# EAGLE schematic Blend V2.0 20170309 (EAGLE 7.5.0)
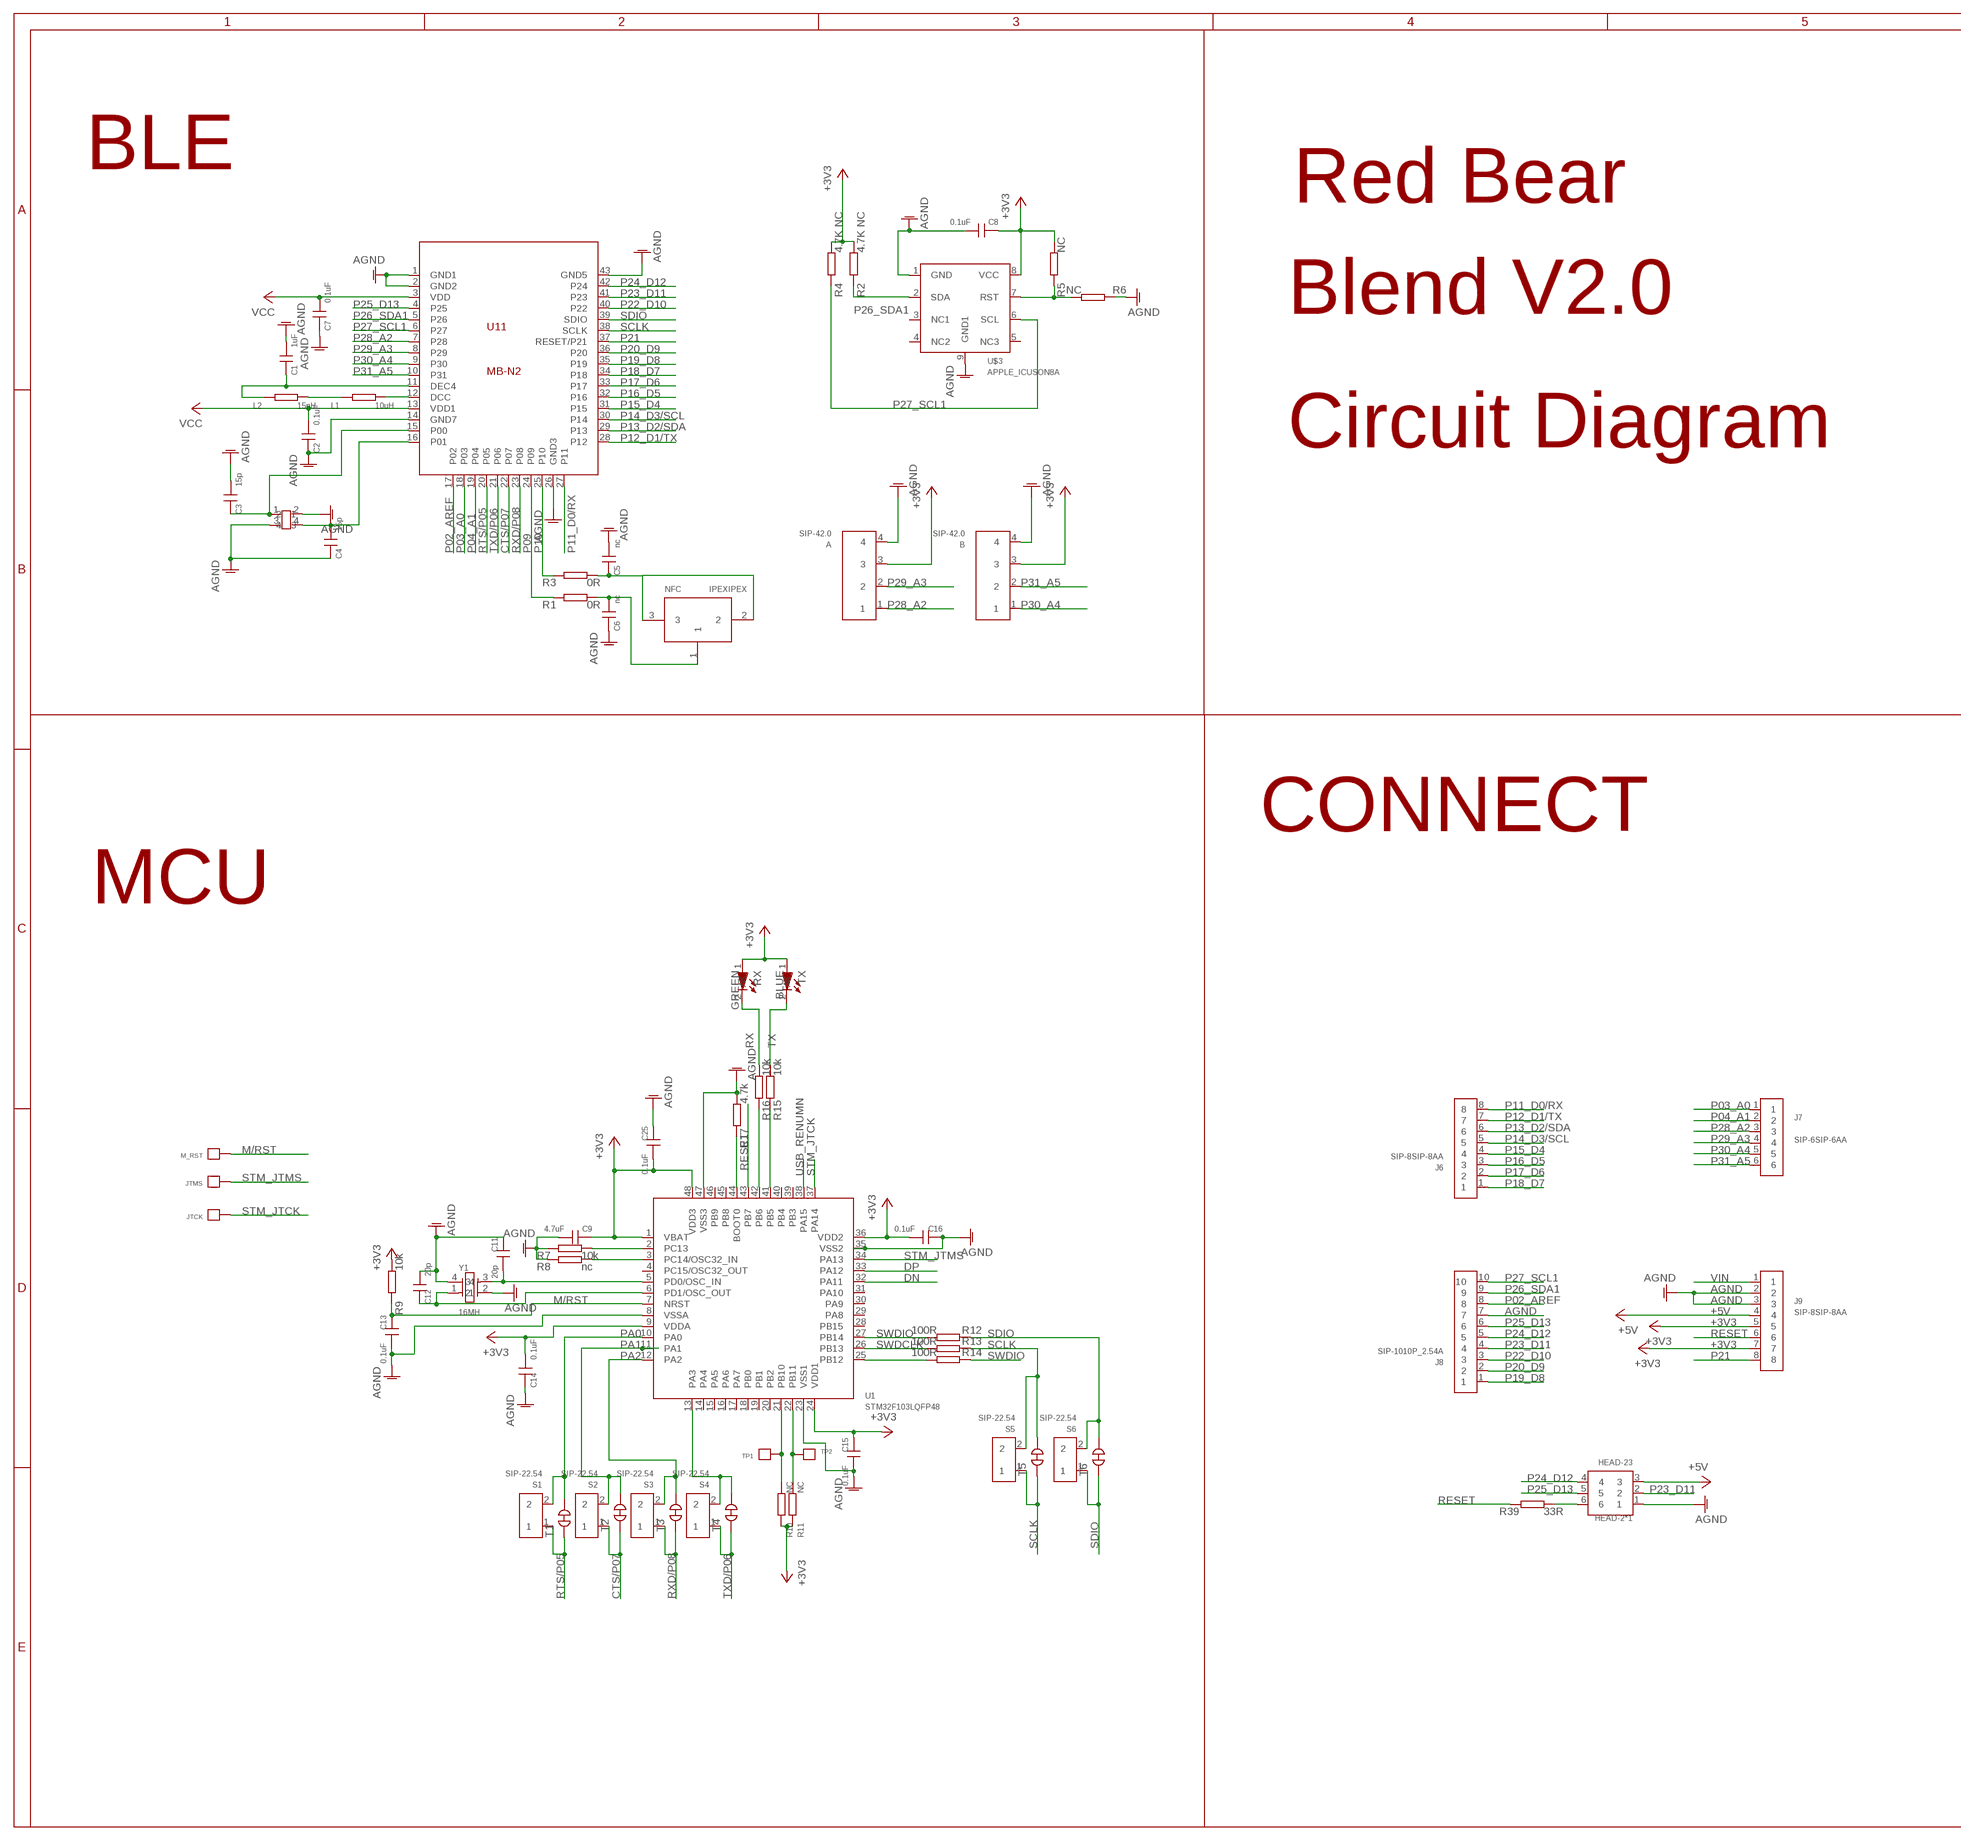
[diagram p0: schematic, sheet 1, part 1 of 2]
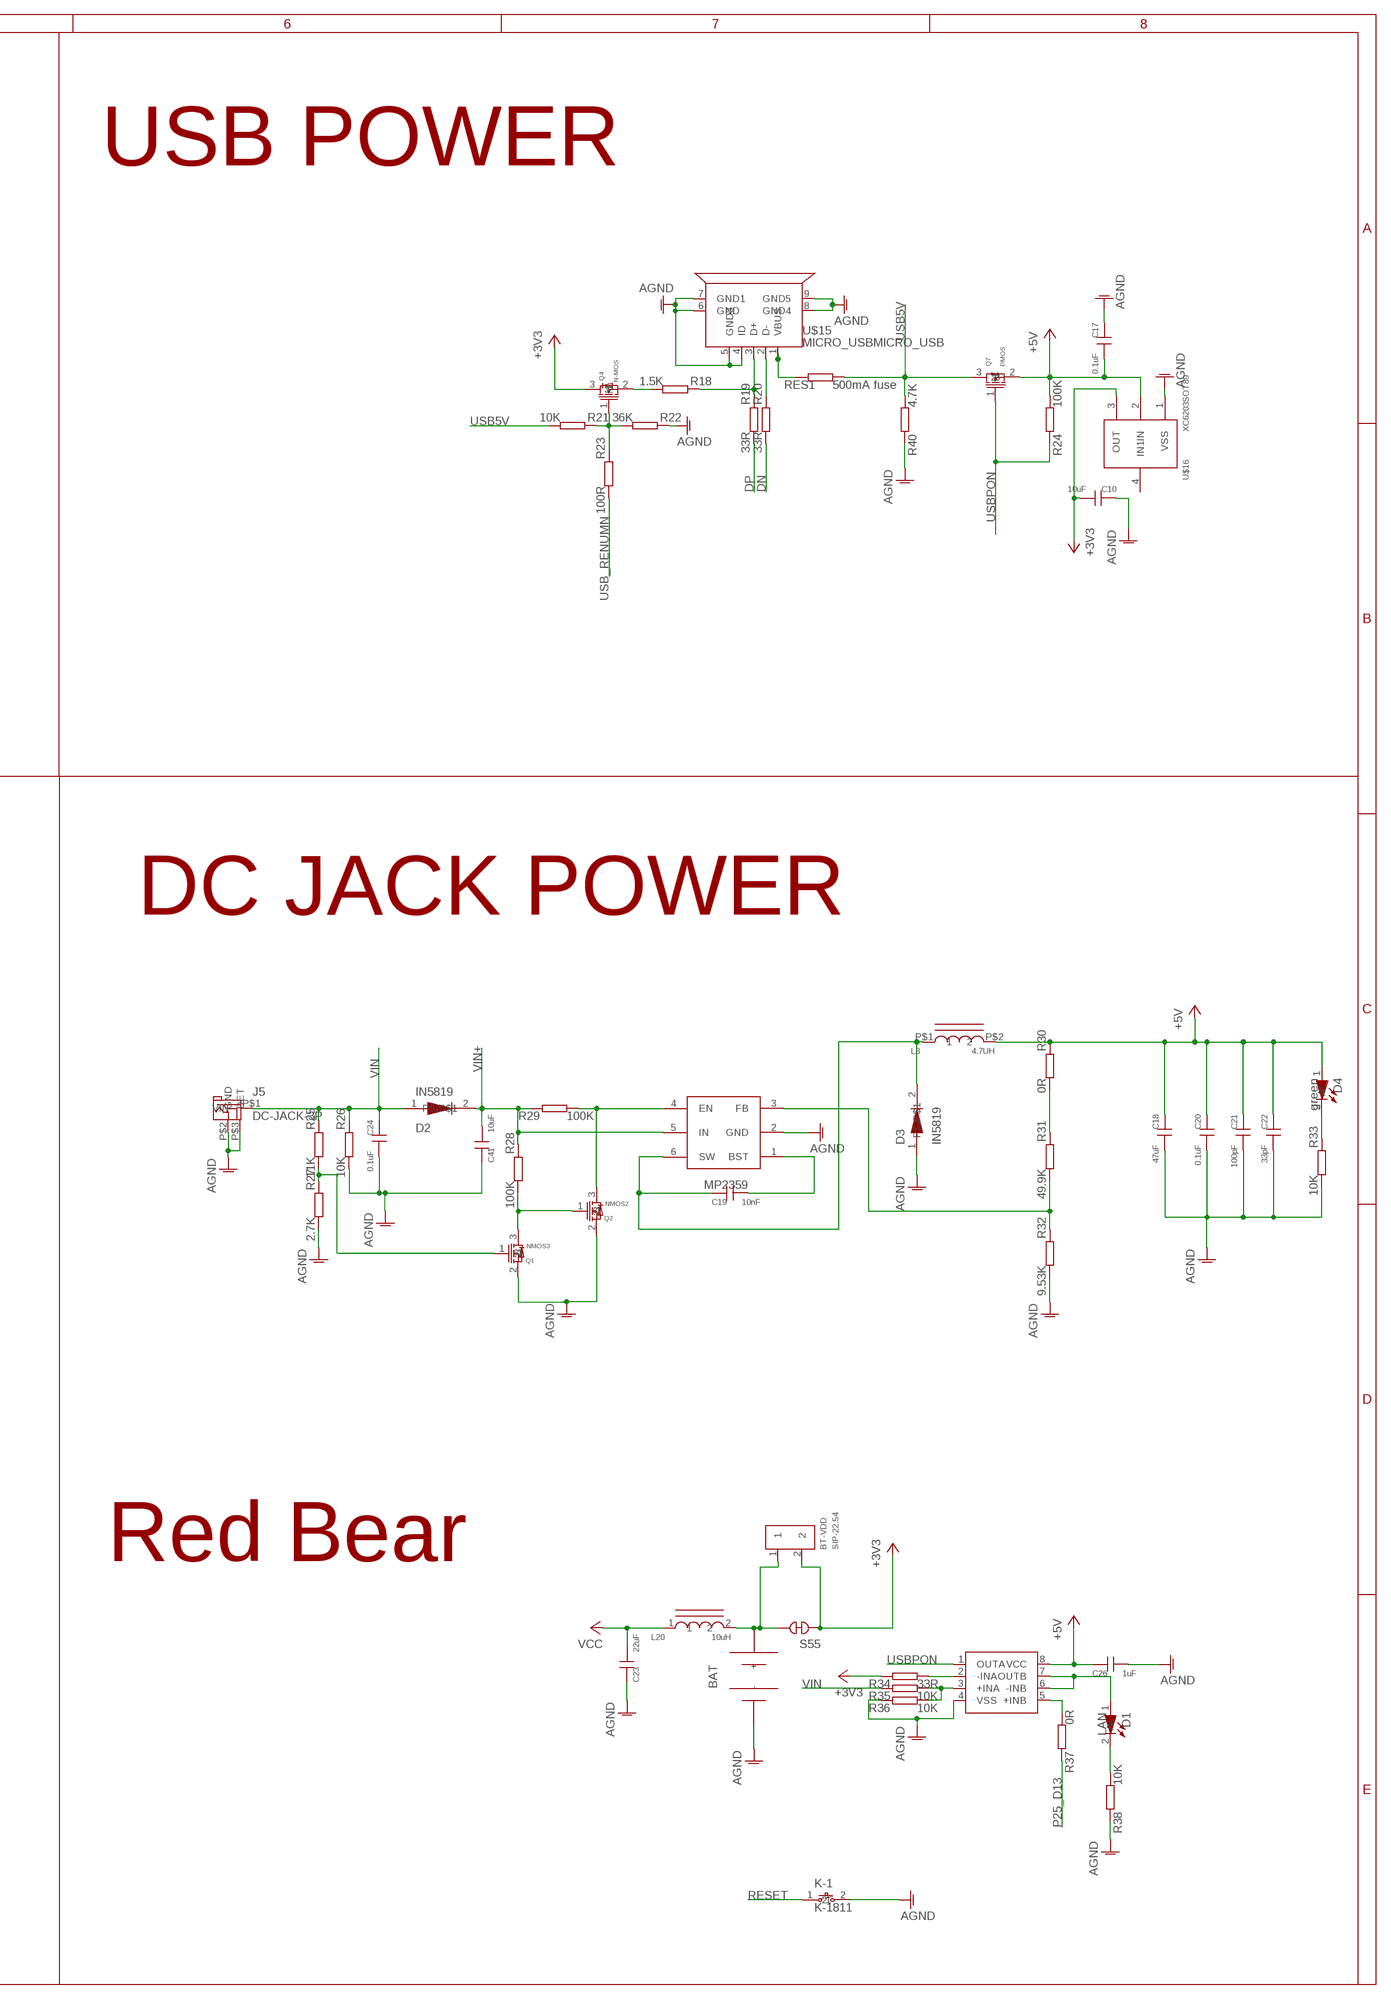
[diagram p1: schematic, sheet 1, part 2 of 2]

## Parts
A  SIP-42.0  [CONETER-4-2.0]
B  SIP-42.0  [CONETER-4-2.0]
BAT  BAT  [BAT]
BT-VDD  SIP-22.54  [SIP-2]
C1  1uF  CAP0402  [C-0402]
C2  0.1uF  CAP0402  [C-0402]
C3  15p  CAP0402  [C-0402]
C4  15p  CAP0402  [C-0402]
C5  nc  CAP0402  [C-0402]
C6  nc  CAP0402  [C-0402]
C7  0.1uF  CAP0402  [C-0402]
C8  0.1uF  CAP0402  [C-0402]
C9  4.7uF  CAP0402  [C-0402]
C10  10uF  CAPC0805  [C0805]
C11  20p  CAP0402  [C-0402]
C12  20p  CAP0402  [C-0402]
C13  0.1uF  CAP0402  [C-0402]
C14  0.1uF  CAP0402  [C-0402]
C15  0.1uF  CAP0402  [C-0402]
C16  0.1uF  CAP0402  [C-0402]
C17  0.1uF  CAP0402  [C-0402]
C18  47uF  CAPC1206  [C1206]
C19  10nF  CAP0402  [C-0402]
C20  0.1uF  CAP0402  [C-0402]
C21  100pF  CAP0402  [C-0402]
C22  33pF  CAP0402  [C-0402]
C23  22uF  CAPC0805  [C0805]
C24  0.1uF  CAP0402  [C-0402]
C25  0.1uF  CAP0402  [C-0402]
C26  1uF  CAP0402  [C-0402]
C41  10uF  CAPC1206  [C1206]
D1  LAN  LEDLED-0603  [LED-0603]
D3  IN5819  DIODED-1810  [D-1810]
D4  green  LEDLED-0603  [LED-0603]
HEAD-2*1  HEAD-23  [PAIZHEN3X2PIN2.54]
IN5819  D2  DIODED-1810  [D-1810]
J5  DC-JACK-3P  DC-005DC-005  [DC-005]
J6  SIP-8SIP-8AA  [PAIZHEN8P_2.54AA]
J7  SIP-6SIP-6AA  [PAIZHEN6P_2.54AA]
J8  SIP-1010P_2.54A  [PAIZHEN10P-2.54A]
J9  SIP-8SIP-8AA  [PAIZHEN8P_2.54AA]
JTCK  TPTP  [TP]
JTMS  TPTP  [TP]
K-1  K-1811  [K2-1101F]
L1  10uH  RESR0603  [R0603]
L2  15nH  RES0402S  [R-0402S]
L3  4.7UH  LL4X4  [L4X4]
L20  10uH  L  [R-0603A]
M_RST  TPTP  [TP]
MP2359  MP2359  [MP2359]
NFC  IPEXIPEX  [IPEX]
NMOS2  Q2  NMOSSOT-23  [SOT-23]
NMOS3  Q1  NMOSSOT-23  [SOT-23]
Q4  N-MOS  NMOSSOT-23  [SOT-23]
Q7  PMOS  [SOT-23]
R1  0R  RESR0402  [R0402]
R2  4.7K NC  RESR0402  [R0402]
R3  0R  RESR0402  [R0402]
R4  4.7K NC  RESR0402  [R0402]
R5  NC  RESR0402  [R0402]
R6  NC  RESR0402  [R0402]
R7  10k  RESR0402  [R0402]
R8  nc  RESR0402  [R0402]
R9  10k  RESR0402  [R0402]
R10  NC  RESR0603  [R0603]
R11  NC  RESR0603  [R0603]
R12  100R  RESR0402  [R0402]
R13  100R  RESR0402  [R0402]
R14  100R  RESR0402  [R0402]
R15  10k  RESR0402  [R0402]
R16  10k  RESR0402  [R0402]
R17  4.7k  RESR0402  [R0402]
R18  1.5K  RESR0402  [R0402]
R19  33R  RESR0402  [R0402]
R20  33R  RESR0402  [R0402]
R21  10K  RESR0402  [R0402]
R22  36K  RESR0402  [R0402]
R23  100R  RESR0402  [R0402]
R24  100K  RESR0402  [R0402]
R25  11K  RESR0402  [R0402]
R26  10K  RESR0402  [R0402]
R27  2.7K  RESR0402  [R0402]
R28  100K  RESR0402  [R0402]
R29  100K  RESR0402  [R0402]
R30  0R  RESR0402  [R0402]
R31  49.9K  RESR0402  [R0402]
R32  9.53K  RESR0402  [R0402]
R33  10K  RESR0402  [R0402]
R34  33R  RESR0402  [R0402]
R35  10K  RESR0402  [R0402]
R36  10K  RESR0402  [R0402]
R37  0R  RESR0402  [R0402]
R38  10K  RESR0402  [R0402]
R39  33R  RESR0402  [R0402]
R40  4.7K  RESR0402  [R0402]
RES1  500mA fuse  RES  [R1206A]
RX  GREEN  LED  [LED0603]
S1  SIP-22.54  [SIP-2]
S2  SIP-22.54  [SIP-2]
S3  SIP-22.54  [SIP-2]
S4  SIP-22.54  [SIP-2]
S5  SIP-22.54  [SIP-2]
S6  SIP-22.54  [SIP-2]
S55  TP_OPEN  [TP_OPEN]
T1  TP_OPEN  [TP_OPEN]
T2  TP_OPEN  [TP_OPEN]
T3  TP_OPEN  [TP_OPEN]
T4  TP_OPEN  [TP_OPEN]
T5  TP_OPEN  [TP_OPEN]
T6  TP_OPEN  [TP_OPEN]
TP1  TPTP  [TP]
TP2  TPTP  [TP]
TX  BLUE  LED  [LED0603]
U1  STM32F103LQFP48  [LQFP-48-7X7]
U11  MB-N2  RBT07  [RBT07]
U$2  CRY_7015  [CRY_7015_SMT]
U$3  APPLE_ICUSON8A  [USON8_A]
U$15  MICRO_USBMICRO_USB  [MICRO_USB]
U$16  XC6203SOT89  [SOT-89]
U$19  SGM358  [SOP-8]
Y1  16MH  CRY3225  [CRY_3225_SMT]

## Nets
+3V3: A.3 B.3 BT-VDD.2 C8.2 C9.2 C10.1 C14.1 C15.2 C16.1 C25.1 J9.5 J9.7 Q4.3 R2.2 R4.2 R5.2 R9.2 R10.1 R11.1 R34.1 RX.1(A) S55.P$2 TX.1(A) U1.1(VBAT) U1.9(VDDA) U1.24(VDD1) U1.36(VDD2) U1.48(VDD3) U$3.8(VCC) U$16.3(OUT)
+5V: C17.1 C18.2 C20.2 C21.2 C22.2 C26.2 D4.1(A) HEAD-2*1.3 J9.4 L3.P$2 Q7.2 R24.2 R30.1 U$16.2(IN) U$19.8(VCC)
AGND: A.4 B.4 BAT.P$2(-) C1.1 C2.2 C3.1 C4.2 C5.1 C6.2 C7.2 C8.1 C9.1 C10.2 C11.2 C12.1 C13.1 C14.2 C15.1 C16.2 C17.2 C18.1 C20.1 C21.1 C22.1 C23.2 C24.1 C25.2 C26.1 C41.2 D3.1 HEAD-2*1.1 J5.P$2(GND) J5.P$3(DET) J8.7 J9.2 J9.3 K-1.2 MP2359.2(GND) NMOS2.2 NMOS3.2 R6.1 R7.1 R8.1 R17.2 R22.1 R26.2 R27.2 R32.2 R33.2 R36.1 R38.1 R40.1 U1.8(VSSA) U1.23(VSS1) U1.35(VSS2) U1.47(VSS3) U11.1(GND1) U11.2(GND2) U11.14(GND7) U11.26(GND3) U11.43(GND5) U$2.2 U$2.3 U$3.1(GND) U$3.9(GND1) U$15.4(ID) U$15.5(GND3) U$15.6(GND) U$15.7(GND1) U$15.8(GND4) U$15.9(GND5) U$16.1(VSS) U$19.4(VSS) Y1.2 Y1.4
CTS/P07: S2.1 T2.P$2 U11.22(P07)
DN: R20.2 U1.32(PA11)
DP: R19.2 U1.33(PA12)
M/RST: C13.2 M_RST.P$1 R9.1 U1.7(NRST)
MP2359: C19.1 MP2359.1(BST)
N$1: L1.1 L2.2
N$2: L1.2 U11.12(DCC)
N$3: C1.2 L2.1 U11.11(DEC4)
N$5: C3.2 U11.15(P00) U$2.1
N$6: C4.1 U11.16(P01) U$2.4
N$7: C5.2 NFC.2 NFC.3 R3.2
N$8: C6.1 NFC.1 R1.2
N$10: R10.2 TP1.P$1 U1.21(PB10)
N$11: R5.1 R6.2 U$3.7(RST)
N$12: C11.1 U1.5(PD0/OSC_IN) Y1.3
N$13: R7.2 U1.2(PC13)
N$14: R8.2 U1.3(PC14/OSC32_IN)
N$15: C12.2 U1.6(PD1/OSC_OUT) Y1.1
N$17: R11.2 TP2.P$1 U1.22(PB11)
N$18: Q4.2 R18.2
N$19: Q4.1 R21.1 R22.2 R23.1
N$20: S4.2 T4.P$1 U1.13(PA3)
N$21: R18.1 R19.1 U$15.3(D+)
N$22: R14.2 U1.25(PB12)
N$23: R15.1 U1.41(PB5)
N$24: R16.1 U1.42(PB6)
N$25: R20.1 U$15.2(D-)
N$26: R17.1 U1.44(BOOT0)
N$29: BAT.P$1(+) BT-VDD.1 L20.2 S55.P$1
N$30: NMOS3.1 R25.2 R27.1
N$31: RES1.1 U$15.1(VBUS)
N$32: NMOS2.1 NMOS3.3 R28.2
N$33: R34.2 U$19.2(-INA)
N$34: R35.2 R36.2 U$19.3(+INA)
N$35: D4.2(K) R33.1
N$36: MP2359.4(EN) NMOS2.3 R29.2
N$37: D1.1(A) U$19.6(-INB) U$19.7(OUTB)
N$39: MP2359.3(FB) R31.2 R32.1
N$40: R30.2 R31.1
N$41: D1.2(K) R38.2
N$42: C19.2 D3.2 L3.P$1 MP2359.6(SW)
N$43: R37.2 U$19.5(+INB)
N$45: HEAD-2*1.6 R39.2
P02_AREF: J8.8 U11.17(P02)
P03_A0: J7.1 U11.18(P03)
P04_A1: J7.2 U11.19(P04)
P09: R1.1 U11.24(P09)
P10: R3.1 U11.25(P10)
P11_D0/RX: J6.8 U11.27(P11)
P12_D1/TX: J6.7 U11.28(P12)
P13_D2/SDA: J6.6 U11.29(P13)
P14_D3/SCL: J6.5 U11.30(P14)
P15_D4: J6.4 U11.31(P15)
P16_D5: J6.3 U11.32(P16)
P17_D6: J6.2 U11.33(P17)
P18_D7: J6.1 U11.34(P18)
P19_D8: J8.1 U11.35(P19)
P20_D9: J8.2 U11.36(P20)
P21: J9.8 U11.37(RESET/P21)
P22_D10: J8.3 U11.40(P22)
P23_D11: HEAD-2*1.2 J8.4 U11.41(P23)
P24_D12: HEAD-2*1.4 J8.5 U11.42(P24)
P25_D13: HEAD-2*1.5 J8.6 R37.1 U11.4(P25)
P26_SDA1: J8.9 R2.1 U11.5(P26) U$3.2(SDA)
P27_SCL1: J8.10 R4.1 U11.6(P27) U$3.6(SCL)
P28_A2: A.1 J7.3 U11.7(P28)
P29_A3: A.2 J7.4 U11.8(P29)
P30_A4: B.1 J7.5 U11.9(P30)
P31_A5: B.2 J7.6 U11.10(P31)
PA0: S1.2 T1.P$1 U1.10(PA0)
PA1: S2.2 T2.P$1 U1.11(PA1)
PA2: S3.2 T3.P$1 U1.12(PA2)
RESET: J9.6 K-1.1 R39.1 U1.43(PB7)
RTS/P05: S1.1 T1.P$2 U11.20(P05)
RX: R16.2 RX.2(K)
RXD/P08: S3.1 T3.P$2 U11.23(P08)
SCLK: R13.1 S5.1 S5.2 T5.P$1 T5.P$2 U11.38(SCLK)
SDIO: R12.1 S6.1 S6.2 T6.P$1 T6.P$2 U11.39(SDIO)
STM_JTCK: JTCK.P$1 U1.37(PA14)
STM_JTMS: JTMS.P$1 U1.34(PA13)
SWDCLK: R13.2 U1.26(PB13)
SWDIO: R12.2 R14.1 U1.27(PB14)
TX: R15.2 TX.2(K)
TXD/P06: S4.1 T4.P$2 U11.21(P06)
USB5V: Q7.3 R21.2 R40.2 RES1.2
USB_RENUMN: R23.2 U1.38(PA15)
USBPON: Q7.1 R24.1 U$19.1(OUTA)
VDD: C2.1 C7.1 C23.1 L20.1 U11.3(VDD) U11.13(VDD1) ; supply symbol labelled VCC
VIN: C24.2 IN5819.1 J5.P$1(VIN) J9.1 R25.1 R26.1 R35.1
VIN+: C41.1 IN5819.2 MP2359.5(IN) R28.1 R29.1
Unconnected: U1.4(PC15/OSC32_OUT) U1.14(PA4) U1.15(PA5) U1.16(PA6) U1.17(PA7) U1.18(PB0) U1.19(PB1) U1.20(PB2) U1.28(PB15) U1.29(PA8) U1.30(PA9) U1.31(PA10) U1.39(PB3) U1.40(PB4) U1.45(PB8) U1.46(PB9) U$3.3(NC1) U$3.4(NC2) U$3.5(NC3)

## Notes on the sheet
- BLE | USB POWER
- Red Bear
- Blend V2.0
- Circuit Diagram
- CONNECT | DC JACK POWER
- MCU
- Red Bear

## Power pins joined to a net without a drawn wire
IN1: U$16.4(IN1)

## Library data of the parts
A B = RedBeard:SIP-4
BAT = RedBeard:BAT
BT-VDD S1-S6 = RedBeard:SIP-2
C1-C9 C11-C17 C19-C22 C24-C26 = Nano2:CAP: CAP
C10 C18 C23 C41 = RedBeard:CAP: CAP
D1 D4 RX TX = RedBeard:LED: LED
D3 IN5819 = RedBeard:DIODE: DIODE
HEAD-2*1 = RedBeard:HEAD-2*3: HEAD-2*3
J5 = RedBeard:DC-005: DC-5
J6 J9 = RedBeard:SIP-8: SIP-8
J7 = RedBeard:SIP-6: SIP-6
J8 = RedBeard:SIP-10: SIP-10
JTCK JTMS M_RST TP1 TP2 = RedBeard:TP
K-1 = RedBeard:K-1811: K-1811
L1 L2 R10 R11 = Nano2:RES: RES
L3 L20 = RedBeard:L
MP2359 = RedBeard:MP2359
NFC = RedBeard:IPEX
NMOS2 NMOS3 Q4 = RedBeard:NMOS: NMOS
Q7 = RedBeard:PMOS: PMOS
R1-R9 R12-R40 RES1 = RedBeard:RES: RES
S55 T1-T6 = RedBeard:TP_OPEN
U1 = RedBeard:STM32F103
U11 = RedBeard:RBT07
U$2 = RedBeard:CRY_7015
U$3 = RedBeard:APPLE_IC
U$15 = RedBeard:MICRO_USB: Micro-USB
U$16 = RedBeard:XC6203
U$19 = RedBeard:SGM358
Y1 = RedBeard:CRY